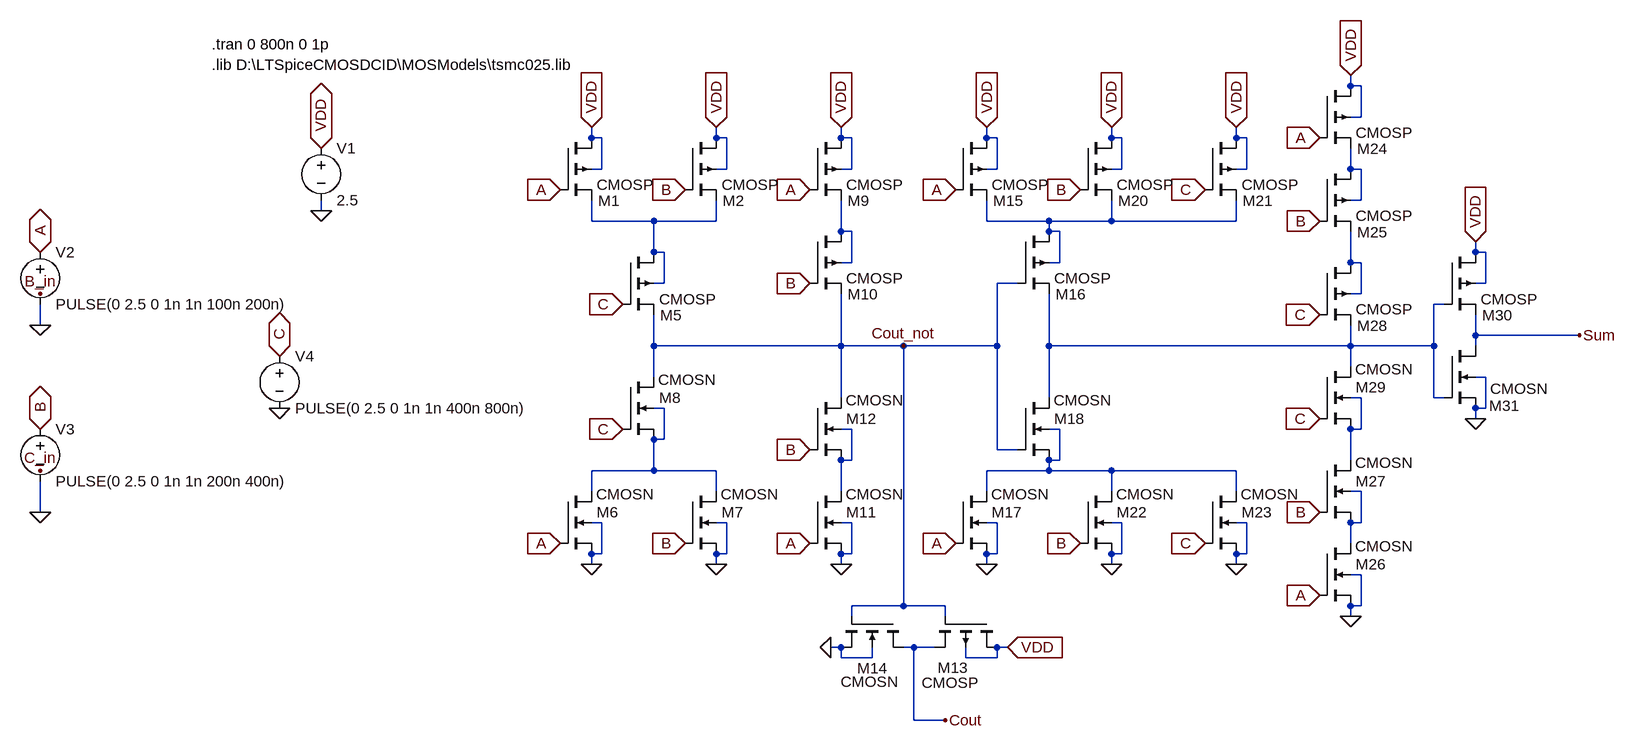
[diagram p0: schematic fulladder.asc]
fulladder.asc, the LTspice schematic file:
Version 4
SHEET 1 3428 1684
WIRE 1744 -320 1744 -336
WIRE 1760 -320 1744 -320
WIRE 1760 -272 1760 -320
WIRE 1760 -272 1744 -272
WIRE 576 -240 576 -256
WIRE 592 -240 576 -240
WIRE 768 -240 768 -256
WIRE 784 -240 768 -240
WIRE 960 -240 960 -256
WIRE 976 -240 960 -240
WIRE 1184 -240 1184 -256
WIRE 1200 -240 1184 -240
WIRE 1376 -240 1376 -256
WIRE 1392 -240 1376 -240
WIRE 1568 -240 1568 -256
WIRE 1584 -240 1568 -240
WIRE 592 -192 592 -240
WIRE 592 -192 576 -192
WIRE 784 -192 784 -240
WIRE 784 -192 768 -192
WIRE 976 -192 976 -240
WIRE 976 -192 960 -192
WIRE 1200 -192 1200 -240
WIRE 1200 -192 1184 -192
WIRE 1392 -192 1392 -240
WIRE 1392 -192 1376 -192
WIRE 1584 -192 1584 -240
WIRE 1584 -192 1568 -192
WIRE 1744 -192 1744 -224
WIRE 1760 -192 1744 -192
WIRE 1760 -144 1760 -192
WIRE 1760 -144 1744 -144
WIRE 160 -128 160 -144
WIRE 576 -112 576 -144
WIRE 672 -112 576 -112
WIRE 768 -112 768 -144
WIRE 768 -112 672 -112
WIRE 1184 -112 1184 -144
WIRE 1280 -112 1184 -112
WIRE 1376 -112 1376 -144
WIRE 1376 -112 1280 -112
WIRE 1568 -112 1568 -144
WIRE 1568 -112 1376 -112
WIRE 960 -96 960 -144
WIRE 976 -96 960 -96
WIRE 1280 -96 1280 -112
WIRE 1296 -96 1280 -96
WIRE 672 -64 672 -112
WIRE 688 -64 672 -64
WIRE 1936 -64 1936 -80
WIRE 1952 -64 1936 -64
WIRE 976 -48 976 -96
WIRE 976 -48 960 -48
WIRE 1296 -48 1296 -96
WIRE 1296 -48 1280 -48
WIRE 1744 -48 1744 -96
WIRE 1760 -48 1744 -48
WIRE 688 -16 688 -64
WIRE 688 -16 672 -16
WIRE 1232 -16 1200 -16
WIRE 1952 -16 1952 -64
WIRE 1952 -16 1936 -16
WIRE 1760 0 1760 -48
WIRE 1760 0 1744 0
WIRE 1888 16 1872 16
WIRE -272 48 -272 16
WIRE 1936 64 1936 32
WIRE 2096 64 1936 64
WIRE 672 80 672 32
WIRE 960 80 960 0
WIRE 960 80 672 80
WIRE 1056 80 960 80
WIRE 1200 80 1200 -16
WIRE 1200 80 1056 80
WIRE 1280 80 1280 0
WIRE 1744 80 1744 48
WIRE 1744 80 1280 80
WIRE 1872 80 1872 16
WIRE 1872 80 1744 80
WIRE 1936 80 1936 64
WIRE 1744 112 1744 80
WIRE 672 128 672 80
WIRE 1952 128 1936 128
WIRE 960 160 960 80
WIRE 1280 160 1280 80
WIRE 1760 160 1744 160
WIRE 1872 160 1872 80
WIRE 1888 160 1872 160
WIRE 688 176 672 176
WIRE 1952 176 1952 128
WIRE 1952 176 1936 176
WIRE 1936 192 1936 176
WIRE 976 208 960 208
WIRE 1296 208 1280 208
WIRE 1760 208 1760 160
WIRE 1760 208 1744 208
WIRE 688 224 688 176
WIRE 688 224 672 224
WIRE 1200 240 1200 80
WIRE 1232 240 1200 240
WIRE 976 256 976 208
WIRE 976 256 960 256
WIRE 1296 256 1296 208
WIRE 1296 256 1280 256
WIRE 1744 256 1744 208
WIRE 672 272 672 224
WIRE 672 272 576 272
WIRE 768 272 672 272
WIRE 1280 272 1280 256
WIRE 1280 272 1184 272
WIRE 1376 272 1280 272
WIRE 1568 272 1376 272
WIRE 576 304 576 272
WIRE 768 304 768 272
WIRE 960 304 960 256
WIRE 1184 304 1184 272
WIRE 1376 304 1376 272
WIRE 1568 304 1568 272
WIRE 1760 304 1744 304
WIRE -272 336 -272 288
WIRE 592 352 576 352
WIRE 784 352 768 352
WIRE 976 352 960 352
WIRE 1200 352 1184 352
WIRE 1392 352 1376 352
WIRE 1584 352 1568 352
WIRE 1760 352 1760 304
WIRE 1760 352 1744 352
WIRE 1744 384 1744 352
WIRE 592 400 592 352
WIRE 592 400 576 400
WIRE 784 400 784 352
WIRE 784 400 768 400
WIRE 976 400 976 352
WIRE 976 400 960 400
WIRE 1200 400 1200 352
WIRE 1200 400 1184 400
WIRE 1392 400 1392 352
WIRE 1392 400 1376 400
WIRE 1584 400 1584 352
WIRE 1584 400 1568 400
WIRE 576 416 576 400
WIRE 768 416 768 400
WIRE 960 416 960 400
WIRE 1184 416 1184 400
WIRE 1376 416 1376 400
WIRE 1568 416 1568 400
WIRE 1760 432 1744 432
WIRE 1056 480 1056 80
WIRE 1056 480 976 480
WIRE 1120 480 1056 480
WIRE 1760 480 1760 432
WIRE 1760 480 1744 480
WIRE 976 496 976 480
WIRE 1120 496 1120 480
WIRE 1744 496 1744 480
WIRE 960 544 944 544
WIRE 1072 544 1056 544
WIRE 1104 544 1072 544
WIRE 1216 544 1200 544
WIRE 960 560 960 544
WIRE 1008 560 1008 544
WIRE 1008 560 960 560
WIRE 1152 560 1152 544
WIRE 1200 560 1200 544
WIRE 1200 560 1152 560
WIRE 1072 656 1072 544
WIRE 1120 656 1072 656
FLAG 576 -256 VDD
IOPIN 576 -256 In
FLAG 768 -256 VDD
IOPIN 768 -256 In
FLAG 576 416 0
FLAG 768 416 0
FLAG 528 -160 A
IOPIN 528 -160 In
FLAG 960 416 0
FLAG 960 -256 VDD
IOPIN 960 -256 In
FLAG 720 -160 B
IOPIN 720 -160 In
FLAG 624 16 C
IOPIN 624 16 In
FLAG 528 384 A
IOPIN 528 384 In
FLAG 720 384 B
IOPIN 720 384 In
FLAG 624 208 C
IOPIN 624 208 In
FLAG 912 -160 A
IOPIN 912 -160 In
FLAG 912 -16 B
IOPIN 912 -16 In
FLAG 912 384 A
IOPIN 912 384 In
FLAG 912 240 B
IOPIN 912 240 In
FLAG 1056 80 Cout_not
FLAG 1216 544 VDD
IOPIN 1216 544 In
FLAG 944 544 0
FLAG 1184 416 0
FLAG 1184 -256 VDD
IOPIN 1184 -256 In
FLAG 1136 -160 A
IOPIN 1136 -160 In
FLAG 1136 384 A
IOPIN 1136 384 In
FLAG 1376 -256 VDD
IOPIN 1376 -256 In
FLAG 1328 -160 B
IOPIN 1328 -160 In
FLAG 1568 -256 VDD
IOPIN 1568 -256 In
FLAG 1520 -160 C
IOPIN 1520 -160 In
FLAG 1376 416 0
FLAG 1328 384 B
IOPIN 1328 384 In
FLAG 1568 416 0
FLAG 1520 384 C
IOPIN 1520 384 In
FLAG 1744 496 0
FLAG 1744 -336 VDD
IOPIN 1744 -336 In
FLAG 1696 -240 A
IOPIN 1696 -240 In
FLAG 1696 -112 B
IOPIN 1696 -112 In
FLAG 1696 464 A
IOPIN 1696 464 In
FLAG 1696 336 B
IOPIN 1696 336 In
FLAG 1696 32 C
IOPIN 1696 32 In
FLAG 1696 192 C
IOPIN 1696 192 In
FLAG 1936 -80 VDD
IOPIN 1936 -80 In
FLAG 1936 192 0
FLAG 1120 656 Cout
FLAG 2096 64 Sum
FLAG -272 0 B_in
FLAG -272 272 C_in
FLAG 160 -128 0
FLAG -272 208 B
IOPIN -272 208 BiDir
FLAG -272 -64 A
IOPIN -272 -64 BiDir
FLAG 160 -224 VDD
IOPIN 160 -224 BiDir
FLAG 96 96 C
IOPIN 96 96 BiDir
FLAG -272 48 0
FLAG -272 336 0
FLAG 96 176 0
DATAFLAG 2080 64 ""
SYMBOL cmosp 528 -240 R0
WINDOW 0 58 97 Left 2
SYMATTR InstName M1
SYMATTR Value2 l=250n w=360n ad=0.1728p as=0.1728p pd=1680n ps=1680n
SYMBOL cmosp 720 -240 R0
WINDOW 0 58 97 Left 2
SYMATTR InstName M2
SYMATTR Value2 l=250n w=360n ad=0.1728p as=0.1728p pd=1680n ps=1680n
SYMBOL cmosp 624 -64 R0
WINDOW 0 58 97 Left 2
SYMATTR InstName M5
SYMATTR Value2 l=250n w=360n ad=0.1728p as=0.1728p pd=1680n ps=1680n
SYMBOL cmosn 528 304 R0
WINDOW 3 55 4 Left 2
SYMATTR InstName M6
SYMATTR Value2 l=250n w=360n ad=0.1728p as=0.1728p pd=1680n ps=1680n
SYMBOL cmosn 720 304 R0
WINDOW 3 55 4 Left 2
SYMATTR InstName M7
SYMATTR Value2 l=250n w=360n ad=0.1728p as=0.1728p pd=1680n ps=1680n
SYMBOL cmosn 624 128 R0
WINDOW 3 55 4 Left 2
SYMATTR InstName M8
SYMATTR Value2 l=250n w=360n ad=0.1728p as=0.1728p pd=1680n ps=1680n
SYMBOL cmosp 912 -240 R0
WINDOW 0 58 97 Left 2
SYMATTR InstName M9
SYMATTR Value2 l=250n w=360n ad=0.1728p as=0.1728p pd=1680n ps=1680n
SYMBOL cmosp 912 -96 R0
WINDOW 0 58 97 Left 2
SYMATTR InstName M10
SYMATTR Value2 l=250n w=360n ad=0.1728p as=0.1728p pd=1680n ps=1680n
SYMBOL cmosn 912 304 R0
WINDOW 3 55 4 Left 2
SYMATTR InstName M11
SYMATTR Value2 l=250n w=360n ad=0.1728p as=0.1728p pd=1680n ps=1680n
SYMBOL cmosn 912 160 R0
WINDOW 3 55 4 Left 2
SYMATTR InstName M12
SYMATTR Value2 l=250n w=360n ad=0.1728p as=0.1728p pd=1680n ps=1680n
SYMBOL cmosp 1200 496 R90
WINDOW 0 79 44 VRight 2
WINDOW 3 102 28 VRight 2
SYMATTR InstName M13
SYMATTR Value2 l=250n w=360n ad=0.1728p as=0.1728p pd=1680n ps=1680n
SYMBOL cmosn 1056 496 R90
WINDOW 3 101 7 VRight 2
WINDOW 0 80 24 VRight 2
SYMATTR InstName M14
SYMATTR Value2 l=250n w=360n ad=0.1728p as=0.1728p pd=1680n ps=1680n
SYMBOL cmosp 1136 -240 R0
WINDOW 0 58 97 Left 2
SYMATTR InstName M15
SYMATTR Value2 l=250n w=360n ad=0.1728p as=0.1728p pd=1680n ps=1680n
SYMBOL cmosp 1232 -96 R0
WINDOW 0 58 97 Left 2
SYMATTR InstName M16
SYMATTR Value2 l=250n w=360n ad=0.1728p as=0.1728p pd=1680n ps=1680n
SYMBOL cmosn 1136 304 R0
WINDOW 3 55 4 Left 2
SYMATTR InstName M17
SYMATTR Value2 l=250n w=360n ad=0.1728p as=0.1728p pd=1680n ps=1680n
SYMBOL cmosn 1232 160 R0
WINDOW 3 55 4 Left 2
SYMATTR InstName M18
SYMATTR Value2 l=250n w=360n ad=0.1728p as=0.1728p pd=1680n ps=1680n
SYMBOL cmosp 1328 -240 R0
WINDOW 0 58 97 Left 2
SYMATTR InstName M20
SYMATTR Value2 l=250n w=360n ad=0.1728p as=0.1728p pd=1680n ps=1680n
SYMBOL cmosp 1520 -240 R0
WINDOW 0 58 97 Left 2
SYMATTR InstName M21
SYMATTR Value2 l=250n w=360n ad=0.1728p as=0.1728p pd=1680n ps=1680n
SYMBOL cmosn 1328 304 R0
WINDOW 3 55 4 Left 2
SYMATTR InstName M22
SYMATTR Value2 l=250n w=360n ad=0.1728p as=0.1728p pd=1680n ps=1680n
SYMBOL cmosn 1520 304 R0
WINDOW 3 55 4 Left 2
SYMATTR InstName M23
SYMATTR Value2 l=250n w=360n ad=0.1728p as=0.1728p pd=1680n ps=1680n
SYMBOL cmosp 1696 -320 R0
WINDOW 0 58 97 Left 2
SYMATTR InstName M24
SYMATTR Value2 l=250n w=360n ad=0.1728p as=0.1728p pd=1680n ps=1680n
SYMBOL cmosp 1696 -192 R0
WINDOW 0 58 97 Left 2
SYMATTR InstName M25
SYMATTR Value2 l=250n w=360n ad=0.1728p as=0.1728p pd=1680n ps=1680n
SYMBOL cmosn 1696 384 R0
WINDOW 3 55 4 Left 2
SYMATTR InstName M26
SYMATTR Value2 l=250n w=360n ad=0.1728p as=0.1728p pd=1680n ps=1680n
SYMBOL cmosn 1696 256 R0
WINDOW 3 55 4 Left 2
SYMATTR InstName M27
SYMATTR Value2 l=250n w=360n ad=0.1728p as=0.1728p pd=1680n ps=1680n
SYMBOL cmosp 1696 -48 R0
WINDOW 0 58 97 Left 2
SYMATTR InstName M28
SYMATTR Value2 l=250n w=360n ad=0.1728p as=0.1728p pd=1680n ps=1680n
SYMBOL cmosn 1696 112 R0
WINDOW 3 55 4 Left 2
SYMATTR InstName M29
SYMATTR Value2 l=250n w=360n ad=0.1728p as=0.1728p pd=1680n ps=1680n
SYMBOL cmosp 1888 -64 R0
WINDOW 0 58 97 Left 2
SYMATTR InstName M30
SYMATTR Value2 l=250n w=360n ad=0.1728p as=0.1728p pd=1680n ps=1680n
SYMBOL cmosn 1888 80 R0
WINDOW 3 71 66 Left 2
WINDOW 0 69 92 Left 2
SYMATTR InstName M31
SYMATTR Value2 l=250n w=360n ad=0.1728p as=0.1728p pd=1680n ps=1680n
SYMBOL voltage 160 -240 R0
WINDOW 123 0 0 Left 0
WINDOW 39 0 0 Left 0
SYMATTR InstName V1
SYMATTR Value 2.5
SYMBOL voltage -272 -80 R0
WINDOW 123 0 0 Left 0
WINDOW 39 0 0 Left 0
SYMATTR InstName V2
SYMATTR Value PULSE(0 2.5 0 1n 1n 100n 200n)
SYMBOL voltage -272 192 R0
WINDOW 123 0 0 Left 0
WINDOW 39 0 0 Left 0
SYMATTR InstName V3
SYMATTR Value PULSE(0 2.5 0 1n 1n 200n 400n)
SYMBOL voltage 96 80 R0
WINDOW 123 0 0 Left 0
WINDOW 39 0 0 Left 0
SYMATTR InstName V4
SYMATTR Value PULSE(0 2.5 0 1n 1n 400n 800n)
TEXT -8 -352 Left 2 !.lib D:\\LTSpiceCMOSDCID\\MOSModels\\tsmc025.lib
TEXT -8 -384 Left 2 !.tran 0 800n 0 1p

The netlist it stands for:
* fulladder.asc
M1 VDD A N002 VDD CMOSP l=250n w=360n ad=0.1728p as=0.1728p pd=1680n ps=1680n
M2 VDD B N002 VDD CMOSP l=250n w=360n ad=0.1728p as=0.1728p pd=1680n ps=1680n
M5 N002 C Cout_not N002 CMOSP l=250n w=360n ad=0.1728p as=0.1728p pd=1680n ps=1680n
M6 N008 A 0 0 CMOSN l=250n w=360n ad=0.1728p as=0.1728p pd=1680n ps=1680n
M7 N008 B 0 0 CMOSN l=250n w=360n ad=0.1728p as=0.1728p pd=1680n ps=1680n
M8 Cout_not C N008 N008 CMOSN l=250n w=360n ad=0.1728p as=0.1728p pd=1680n ps=1680n
M9 VDD A N004 VDD CMOSP l=250n w=360n ad=0.1728p as=0.1728p pd=1680n ps=1680n
M10 N004 B Cout_not N004 CMOSP l=250n w=360n ad=0.1728p as=0.1728p pd=1680n ps=1680n
M11 N009 A 0 0 CMOSN l=250n w=360n ad=0.1728p as=0.1728p pd=1680n ps=1680n
M12 Cout_not B N009 N009 CMOSN l=250n w=360n ad=0.1728p as=0.1728p pd=1680n ps=1680n
M13 VDD Cout_not Cout VDD CMOSP l=250n w=360n ad=0.1728p as=0.1728p pd=1680n ps=1680n
M14 Cout Cout_not 0 0 CMOSN l=250n w=360n ad=0.1728p as=0.1728p pd=1680n ps=1680n
M15 VDD A N003 VDD CMOSP l=250n w=360n ad=0.1728p as=0.1728p pd=1680n ps=1680n
M16 N003 Cout_not N006 N003 CMOSP l=250n w=360n ad=0.1728p as=0.1728p pd=1680n ps=1680n
M17 N010 A 0 0 CMOSN l=250n w=360n ad=0.1728p as=0.1728p pd=1680n ps=1680n
M18 N006 Cout_not N010 N010 CMOSN l=250n w=360n ad=0.1728p as=0.1728p pd=1680n ps=1680n
M20 VDD B N003 VDD CMOSP l=250n w=360n ad=0.1728p as=0.1728p pd=1680n ps=1680n
M21 VDD C N003 VDD CMOSP l=250n w=360n ad=0.1728p as=0.1728p pd=1680n ps=1680n
M22 N010 B 0 0 CMOSN l=250n w=360n ad=0.1728p as=0.1728p pd=1680n ps=1680n
M23 N010 C 0 0 CMOSN l=250n w=360n ad=0.1728p as=0.1728p pd=1680n ps=1680n
M24 VDD A N001 VDD CMOSP l=250n w=360n ad=0.1728p as=0.1728p pd=1680n ps=1680n
M25 N001 B N005 N001 CMOSP l=250n w=360n ad=0.1728p as=0.1728p pd=1680n ps=1680n
M26 N011 A 0 0 CMOSN l=250n w=360n ad=0.1728p as=0.1728p pd=1680n ps=1680n
M27 N007 B N011 N011 CMOSN l=250n w=360n ad=0.1728p as=0.1728p pd=1680n ps=1680n
M28 N005 C N006 N005 CMOSP l=250n w=360n ad=0.1728p as=0.1728p pd=1680n ps=1680n
M29 N006 C N007 N007 CMOSN l=250n w=360n ad=0.1728p as=0.1728p pd=1680n ps=1680n
M30 VDD N006 Sum VDD CMOSP l=250n w=360n ad=0.1728p as=0.1728p pd=1680n ps=1680n
M31 Sum N006 0 0 CMOSN l=250n w=360n ad=0.1728p as=0.1728p pd=1680n ps=1680n
V1 VDD 0 2.5
V2 A 0 PULSE(0 2.5 0 1n 1n 100n 200n)
V3 B 0 PULSE(0 2.5 0 1n 1n 200n 400n)
V4 C 0 PULSE(0 2.5 0 1n 1n 400n 800n)
.model NMOS NMOS
.model PMOS PMOS
.lib standard.mos
.lib D:\LTSpiceCMOSDCID\MOSModels\tsmc025.lib
.tran 0 800n 0 1p
.backanno
.end

* Results of the author's LTspice run, read from the files saved beside the schematic
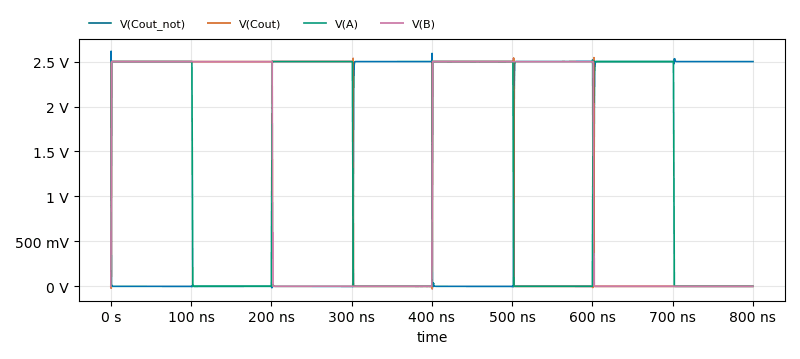
[diagram p1: Transient Analysis of fulladder.asc, plotted from the saved traces]
* Transient Analysis, 1 run:
*   V(Cout_not): min -16.6 mV, max 2.615 V, average 1.235 V, rms 1.755 V, last 2.5 V
*   V(Cout): min -28.16 mV, max 2.544 V, average 1.263 V, rms 1.777 V, last 0 V
*   V(A): min 0 V, max 2.5 V, average 1.262 V, rms 1.774 V, last 0 V
*   V(B): min 0 V, max 2.5 V, average 1.256 V, rms 1.771 V, last 0 V